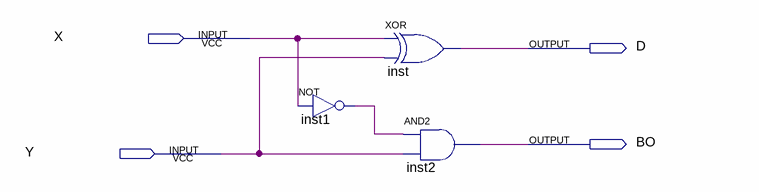
[diagram p0: schematic sheet]
// Quartus schematic half_sub_bdf.bdf as structural Verilog: 3 symbols, 4 pins
module half_sub_bdf (
  input  X,
  input  Y,
  output D,
  output BO
);

  wire inst1_out;

  not inst1 (inst1_out, X);
  xor inst (D, X, Y);
  and inst2 (BO, inst1_out, Y);
endmodule
